# EAGLE design VisualightMicroBulb_03 (EAGLE 6.2)
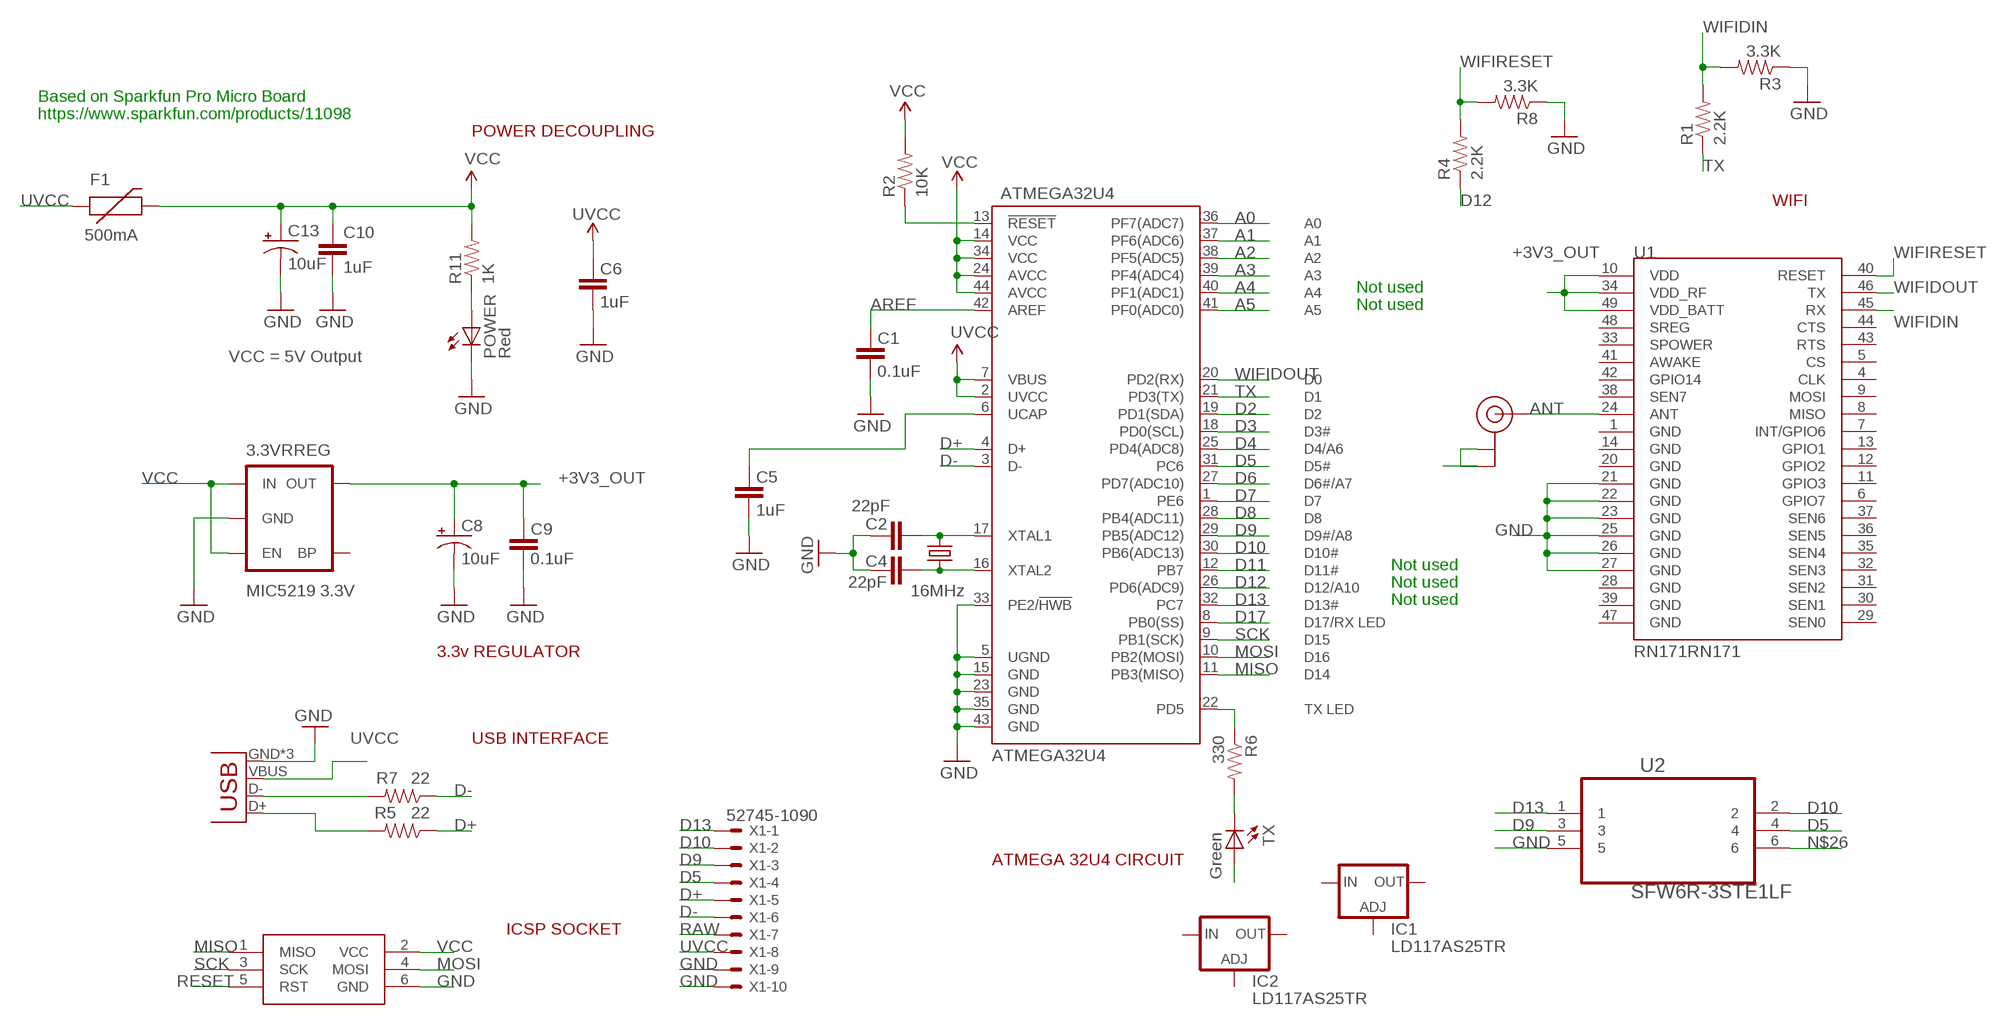
[diagram p0: schematic, sheet 1]

## Parts
3.3VRREG  MIC5219 3.3V  V_REG_MIC52193.3V  [SOT23-5]
ATMEGA32U4  ATMEGA32U4  ATMEGA32U4TQFP  [SPARKFUN-DIGITALIC_TQFP44]
C1  0.1uF  CAP0402-CAP  [0402-CAP]
C2  22pF  CAP0402-CAP  [0402-CAP]
C4  22pF  CAP0402-CAP  [0402-CAP]
C5  1uF  CAP0402-CAP  [0402-CAP]
C6  1uF  CAP0402-CAP  [0402-CAP]
C8  10uF  CAP_POL1206  [EIA3216]
C9  0.1uF  CAP0402-CAP  [0402-CAP]
C10  1uF  CAP0402-CAP  [0402-CAP]
C13  10uF  CAP_POL1206  [EIA3216]
F1  500mA  PTCSMD  [PTC-1206]
IC1  LD117AS25TR  [SOT223]
IC2  LD117AS25TR  [SOT223]
ISP1  AVRISP-6  [AVRISP]
POWER  Red  LED0603  [LED-0603]
R1  2.2K  RESISTOR0402-RES  [0402-RES]
R2  10K  RESISTOR0402-RES  [0402-RES]
R3  3.3K  RESISTOR0402-RES  [0402-RES]
R4  2.2K  RESISTOR0402-RES  [0402-RES]
R5  22  RESISTOR0402-RES  [0402-RES]
R6  330  RESISTOR0402-RES  [0402-RES]
R7  22  RESISTOR0402-RES  [0402-RES]
R8  3.3K  RESISTOR0402-RES  [0402-RES]
R11  1K  RESISTOR0402-RES  [0402-RES]
TX  Green  LED0603  [LED-0603]
U1  RN171RN171  [RN171]
U2  SFW6R-3STE1LF  [FCI_SFW6R-3STE1LF]
U$1  U.FL  [U.FL]
X1  52745-1090  [52745-1090]
X2  USB-MICROB  [USB-MICROB]
Y1  16MHz  CRYSTAL5X3  [CRYSTAL-SMD-5X3]

## Nets
+3V3_OUT: 3.3VRREG.5(OUT) C8.A(+) C9.2 U1.10(VDD) U1.34(VDD_RF) U1.49(VDD_BATT)
A0: ATMEGA32U4.36(PF7(ADC7))
A1: ATMEGA32U4.37(PF6(ADC6))
A2: ATMEGA32U4.38(PF5(ADC5))
A3: ATMEGA32U4.39(PF4(ADC4))
A4: ATMEGA32U4.40(PF1(ADC1))
A5: ATMEGA32U4.41(PF0(ADC0))
ANT: U1.24(ANT) U$1.P$3(SIGNAL)
AREF: ATMEGA32U4.42(AREF) C1.2
D2: ATMEGA32U4.19(PD1(SDA))
D3: ATMEGA32U4.18(PD0(SCL))
D4: ATMEGA32U4.25(PD4(ADC8))
D5: ATMEGA32U4.31(PC6) U2.4 X1.4
D6: ATMEGA32U4.27(PD7(ADC10))
D7: ATMEGA32U4.1(PE6)
D8: ATMEGA32U4.28(PB4(ADC11))
D9: ATMEGA32U4.29(PB5(ADC12)) U2.3 X1.3
D10: ATMEGA32U4.30(PB6(ADC13)) U2.2 X1.2
D11: ATMEGA32U4.12(PB7)
D12: ATMEGA32U4.26(PD6(ADC9)) R4.1
D13: ATMEGA32U4.32(PC7) U2.1 X1.1
D17: ATMEGA32U4.8(PB0(SS))
D+: ATMEGA32U4.4(D+) R5.1 X1.5
D-: ATMEGA32U4.3(D-) R7.1 X1.6
GND [vcc]: 3.3VRREG.2(GND) ATMEGA32U4.5(UGND) ATMEGA32U4.15(GND) ATMEGA32U4.23(GND) ATMEGA32U4.33(PE2/!HWB) ATMEGA32U4.35(GND) ATMEGA32U4.43(GND) C1.1 C2.2 C4.2 C5.1 C6.1 C8.C(-) C9.1 C10.2 C13.C(-) ISP1.6(GND) POWER.C R3.1 R8.1 U1.21(GND) U1.22(GND) U1.23(GND) U1.25(GND) U1.26(GND) U1.27(GND) U2.5 U$1.P$1(GND) U$1.P$2(GND) X1.9 X1.10 X2.GND X2.MT1(GND) X2.MT2(GND)
MISO: ATMEGA32U4.11(PB3(MISO)) ISP1.1(MISO)
MOSI: ATMEGA32U4.10(PB2(MOSI)) ISP1.4(MOSI)
N$1: ATMEGA32U4.16(XTAL2) C4.1 Y1.1
N$2: ATMEGA32U4.17(XTAL1) C2.1 Y1.3
N$4: ATMEGA32U4.6(UCAP) C5.2
N$6: R7.2 X2.D-
N$7: R6.2 TX.C
N$8: R5.2 X2.D+
N$26: U2.6
N$38: POWER.A R11.1
RAW: X1.7
RESET: ATMEGA32U4.13(!RESET) ISP1.5(RST) R2.1
SCK: ATMEGA32U4.9(PB1(SCK)) ISP1.3(SCK)
TX: ATMEGA32U4.21(PD3(TX)) R1.1
TXLED: ATMEGA32U4.22(PD5) R6.1
UVCC: ATMEGA32U4.2(UVCC) ATMEGA32U4.7(VBUS) C6.2 F1.1 X1.8 X2.VBUS
VCC: 3.3VRREG.1(IN) 3.3VRREG.3(EN) ATMEGA32U4.14(VCC) ATMEGA32U4.24(AVCC) ATMEGA32U4.34(VCC) ATMEGA32U4.44(AVCC) C10.1 C13.A(+) F1.2 ISP1.2(VCC) R2.2 R11.2 TX.A
WIFIDIN: R1.2 R3.2 U1.45(RX)
WIFIDOUT: ATMEGA32U4.20(PD2(RX)) U1.46(TX)
WIFIRESET: R4.2 R8.2 U1.40(RESET)
Unconnected: 3.3VRREG.4(BP) IC1.1(ADJ) IC1.3(IN) IC1.4(OUT) IC2.1(ADJ) IC2.3(IN) IC2.4(OUT) U1.1(GND) U1.4(CLK) U1.5(CS) U1.6(GPIO7) U1.7(INT/GPIO6) U1.8(MISO) U1.9(MOSI) U1.11(GPIO3) U1.12(GPIO2) U1.13(GPIO1) U1.14(GND) U1.20(GND) U1.28(GND) U1.29(SEN0) U1.30(SEN1) U1.31(SEN2) U1.32(SEN3) U1.33(SPOWER) U1.35(SEN4) U1.36(SEN5) U1.37(SEN6) U1.38(SEN7) U1.39(GND) U1.41(AWAKE) U1.42(GPIO14) U1.43(RTS) U1.44(CTS) U1.47(GND) U1.48(SREG)

## Notes on the sheet
- Based on Sparkfun Pro Micro Board
- https://www.sparkfun.com/products/11098
- POWER DECOUPLING
- WIFI
- Not used
- Not used
- VCC = 5V Output
- Not used
- Not used
- Not used
- 3.3v REGULATOR
- USB INTERFACE
- ATMEGA 32U4 CIRCUIT
- ICSP SOCKET

## Library data of the parts
3.3VRREG = SparkFun-PowerIC:V_REG_MIC5219: V_REG MIC5219 Standard 500mA LDO voltage regulator in SOT-23 layout. Micrel part MIC5219. BP (by-pass) pin is used to lower output noise with 470pF cap, may be left open.; PROD_ID: VREG-09872
ATMEGA32U4 = SparkFun-DigitalIC:ATMEGA32U4: Atmel 44-pin 8-bit Microcontroller with 32KBytes of ISP Flash and USB Controller
C1 C2 C4-C6 C9 C10 = SparkFun:CAP: Capacitor Standard 0603 ceramic capacitor, and 0.1" leaded capacitor.
C8 C13 = SparkFun:CAP_POL: Capacitor Polarized These are standard SMD and PTH capacitors. Normally 10uF, 47uF, and 100uF in electrolytic and tantalum varieties. Always verify the external diameter of the through hole cap, it varies with capacity, voltage, and manufacturer. The EIA devices should be standard.
F1 = SparkFun:PTC: Resettable Fuse PTC Resettable Fuse. Spark Fun Electronics SKU : COM-08357
IC1 IC2 = v-reg:LD117A?*: Low drop fixed and adjustable positive voltage regulators 1 A Source: http://www.st.com/stonline/products/literature/ds/7194/ld1117axx.pdf
ISP1 = adafruit:AVRISP: AVR ISP HEADER Standard 6 pin header for AVR programming
POWER TX = SparkFun:LED: LEDs Standard schematic elements and footprints for 5mm, 3mm, 1206, and 0603 sized LEDs. 5mm - Spark Fun Electronics SKU : COM-00529 (and others)
R1-R8 R11 = SparkFun:RESISTOR: Resistor Basic schematic elements and footprints for 0603, 1206, and PTH resistors.
U1 = SparkFun-RF:RN171: WiFi Module
U2 = FCI_By_element14_Batch_1:SFW6R-3STE1LF: FFC/FPC CONNECTOR, RECEPTACLE, 6POS 1ROW; MPN: SFW6R-3STE1LF; OC_FARNELL: 1835600; OC_NEWARK: 62K5642; PACKAGE: CONNECTOR-6POS; SUPPLIER: FCI
U$1 = SparkFun-Connectors:U.FL: SMD antenna connector- WRL-09144
X1 = con-molex:52745-1090: FFC/FPC-to-Board 0.50mm (.020") SMT Top Contact Right Angle, ZIF, Style Receptacle 52745 / 52435 Source: http://www.molex.com/product/ffc/52745.html; MPN: 52745-1090; OC_FARNELL: unknown; OC_NEWARK: 92M6380
X2 = SparkFun-Connectors:USB: USB Connectors USB-B-PTH is fully proven SKU : PRT-00139/CONN-08278 USB-miniB is fully proven SKU : PRT-00587 USB-A-PCB is untested. USB-A-H is throughly reviewed, but untested. Spark Fun Electronics SKU : PRT-00437 USB-B-SMT is throughly reviewed, but untested. Needs silkscreen touching up. USB-A-S has not been used/tested USB-MB-H has not been used/tested USB-MICROB has been used. CONN-09505; PROD_ID: CONN-09505
Y1 = SparkFun:CRYSTAL: Crystals Various standard crystals. Proven footprints. Spark Fun Electronics SKU : COM-00534

## Net classes
0 default: width 0.003 mm, drill 0.254 mm, clearance 0.152 mm

## Board
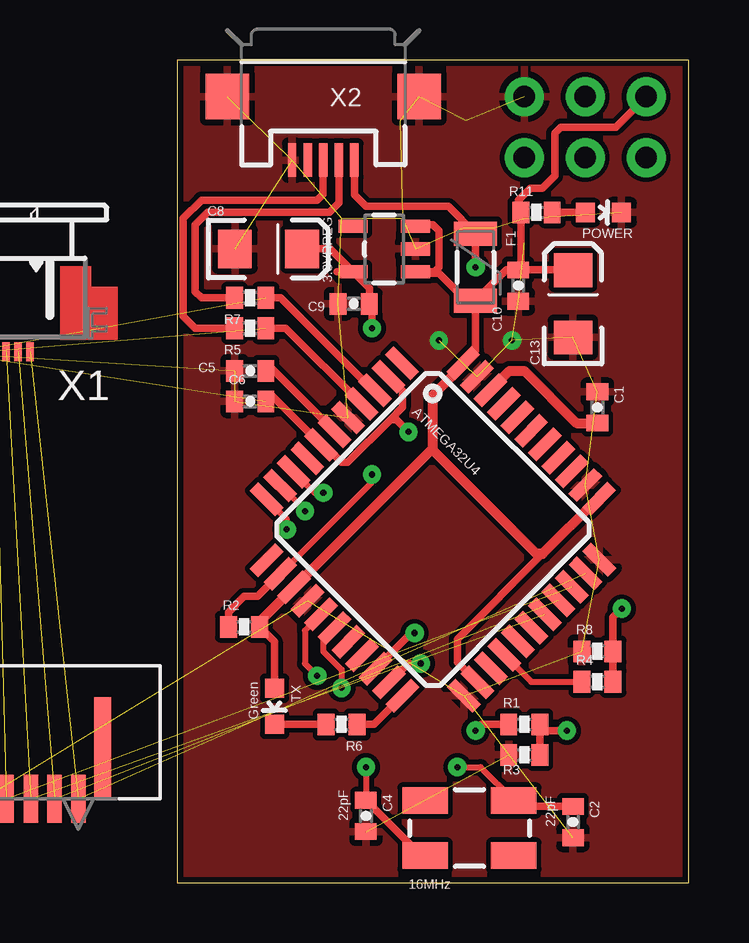
[diagram p1: board, top side]
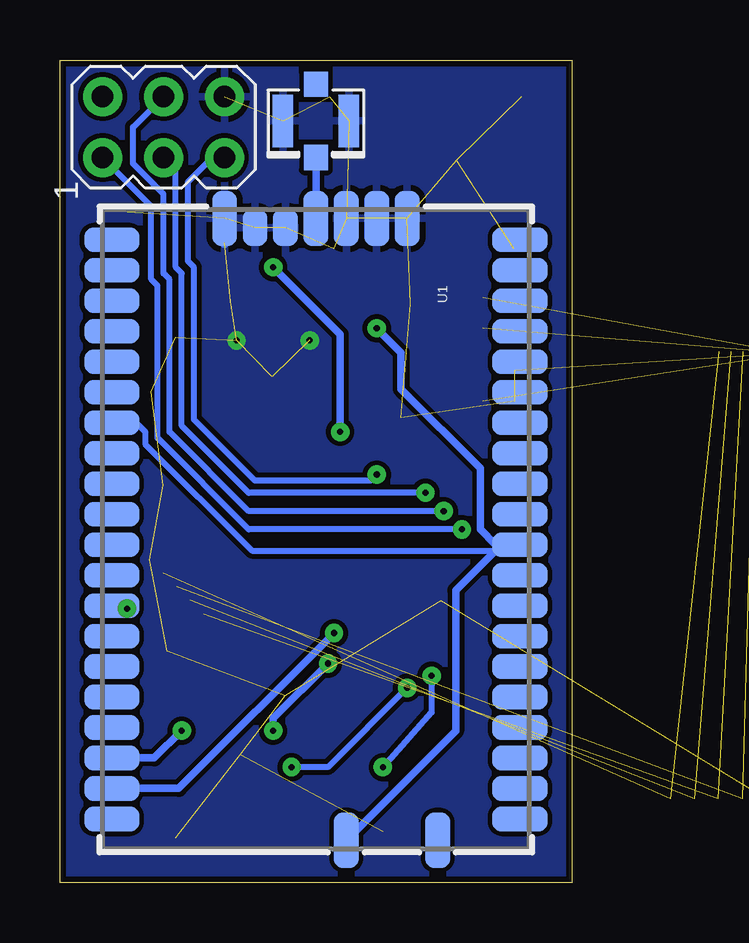
[diagram p2: board, bottom side, seen from below]

Size 21.34 x 34.29 mm. Coordinates in mm from the lower left corner, seen from the top.
Outline: 0,34.29 0,0 21.34,0 21.34,34.29 0,34.29
Copper layers (1*16): Top 0.035mm / dielectric 1.5mm / Bottom 0.035mm
Design rules: minimum track width 8mil, minimum drill 20mil, track to track 8mil, track to pad 8mil, pad to pad 8mil, via to via 8mil, smd to smd 8mil, copper to edge 10mil, drill to drill 8mil, minimum pad ring 12mil, minimum via ring 10mil, stop-mask expansion 4mil, vias tented up to drill 25mil, thermal gap 10mil

### Footprints (pad centres in the part's own frame; a part is rotated, then mirrored left to right if it is on the bottom)
SOT23-5 = smd 0.55 x 1.2: 1 -0.95,-1.3; 2 0,-1.3; 3 0.95,-1.3; 4 0.95,1.3; 5 -0.95,1.3
SPARKFUN-DIGITALIC_TQFP44 = smd 1.5 x 0.5: 1 -5.8,4; 2 -5.8,3.2; 3 -5.8,2.4; 4 -5.8,1.6; 5 -5.8,0.8; 6 -5.8,0; 7 -5.8,-0.8; 8 -5.8,-1.6; 9 -5.8,-2.4; 10 -5.8,-3.2; 11 -5.8,-4; 23 5.8,-4; 24 5.8,-3.2; 25 5.8,-2.4; 26 5.8,-1.6; 27 5.8,-0.8; 28 5.8,0; 29 5.8,0.8; 30 5.8,1.6; 31 5.8,2.4; 32 5.8,3.2; 33 5.8,4 | smd 0.5 x 1.5: 12 -4,-5.8; 13 -3.2,-5.8; 14 -2.4,-5.8; 15 -1.6,-5.8; 16 -0.8,-5.8; 17 0,-5.8; 18 0.8,-5.8; 19 1.6,-5.8; 20 2.4,-5.8; 21 3.2,-5.8; 22 4,-5.8; 34 4,5.8; 35 3.2,5.8; 36 2.4,5.8; 37 1.6,5.8; 38 0.8,5.8; 39 0,5.8; 40 -0.8,5.8; 41 -1.6,5.8; 42 -2.4,5.8; 43 -3.2,5.8; 44 -4,5.8
0402-CAP = smd 0.7 x 0.9: 1 -0.65,0; 2 0.65,0
EIA3216 = smd 1.4 x 1.6: A 1.4,0; C -1.4,0
PTC-1206 = smd 1 x 1.8: 1 -1.4,0; 2 1.4,0
SOT223 = smd 1.5 x 2: 1 -2.3,-3.15; 2 0,-3.15; 3 2.3,-3.15 | smd 3.8 x 2: 4 0,3.15
AVRISP = drill 0.9 pad 1.626: 1 -1.27,2.54; 2 1.27,2.54; 3 -1.27,0; 4 1.27,0; 5 -1.27,-2.54; 6 1.27,-2.54
LED-0603 = smd 0.8 x 0.8: A 0,-0.75; C 0,0.75
0402-RES = smd 0.7 x 0.9: 1 -0.65,0; 2 0.65,0
RN171 = smd 1.016 x 2.286: 1 12.065,8.509; 2 10.795,8.509; 3 9.525,8.509; 4 8.255,8.509; 5 6.985,8.509; 6 5.715,8.509; 7 4.445,8.509; 8 3.175,8.509; 9 1.905,8.509; 10 0.635,8.509; 11 -0.635,8.509; 12 -1.905,8.509; 13 -3.175,8.509; 14 -4.445,8.509; 15 -5.715,8.509; 16 -6.985,8.509; 17 -8.255,8.509; 18 -9.525,8.509; 19 -10.795,8.509; 20 -12.065,8.509; 28 -12.065,-8.509; 29 -10.795,-8.509; 30 -9.525,-8.509; 31 -8.255,-8.509; 32 -6.985,-8.509; 33 -5.715,-8.509; 34 -4.445,-8.509; 35 -3.175,-8.509; 36 -1.905,-8.509; 37 -0.635,-8.509; 38 0.635,-8.509; 39 1.905,-8.509; 40 3.175,-8.509; 41 4.445,-8.509; 42 5.715,-8.509; 43 6.985,-8.509; 44 8.255,-8.509; 45 9.525,-8.509; 46 10.795,-8.509; 47 12.065,-8.509 | smd 2.286 x 1.016: 21 -12.954,3.81; 22 -12.954,2.54; 23 -12.954,1.27; 24 -12.954,0; 27 -12.954,-3.81; 48 12.954,5.08; 49 12.954,1.27 | smd 1.524 x 1.016: 25 -12.573,-1.27; 26 -12.573,-2.54
FCI_SFW6R-3STE1LF = smd 0.61 x 2.007: 1 2.489,2.743; 2 1.499,2.743; 3 0.508,2.743; 4 -0.508,2.743; 5 -1.499,2.743; 6 -2.489,2.743 | smd 0.711 x 4.191: 7 -3.505,4.877; 8 3.505,4.877
U.FL = smd 2.2 x 0.85: P$1 0,1.375; P$2 0,-1.375 | smd 1.05 x 1: P$3 1.525,0; P$4 -1.525,0
52745-1090 = smd 0.3 x 0.8: 1 -2.25,2.5; 2 -1.75,2.5; 3 -1.25,2.5; 4 -0.75,2.5; 5 -0.25,2.5; 6 0.25,2.5; 7 0.75,2.5; 8 1.25,2.5; 9 1.75,2.5; 10 2.25,2.5
USB-MICROB = smd 0.35 x 1.4: D+ 0,2.65; D- -0.65,2.65; GND 1.3,2.65; ID 0.65,2.65; VBUS -1.3,2.65 | smd 1.8 x 1.9: MT1 -4,0; MT2 4,0
CRYSTAL-SMD-5X3 = smd 1.9 x 1.1: 1 -1.85,-1.15; 2 1.85,-1.15; 3 1.85,1.15; 4 -1.85,1.15

### Placement (x,y rotation side)
3.3VRREG  8.64,26.42 90 top
ATMEGA32U4  10.67,14.73 315.1 top
C1  17.53,19.81 270 top
C2  16.51,2.54 270 top
C4  7.87,2.79 270 top
C5  3.05,21.34 0 top
C6  3.05,20.07 0 top
C8  3.81,26.42 0 top
C9  7.37,24.13 0 top
C10  14.22,24.89 270 top
C13  16.51,24.13 90 top
F1  12.45,25.65 270 top
IC1  -17.78,3.56 0 top  (outside the outline)
IC2  -26.16,3.56 0 top  (outside the outline)
ISP1  17.02,31.5 90 bottom
POWER  17.78,27.94 270 top
R1  14.48,6.6 0 top
R2  2.79,10.67 0 top
R3  14.48,5.33 0 top
R4  17.53,8.38 0 top
R5  3.05,23.11 180 top
R6  6.86,6.6 180 top
R7  3.05,24.38 180 top
R8  17.53,9.65 0 top
R11  14.99,27.94 180 top
TX  4.06,7.37 180 top
U1  10.67,14.73 270 bottom
U2  -6.6,0.76 0 top  (outside the outline)
U$1  10.67,31.75 270 bottom
X1  -8.38,24.64 180 top  (outside the outline)
X2  6.1,32.77 180 top
Y1  12.19,2.29 0 top

### Tracks (layer width: path | path; a pad name or v marks a point on that pad's centre or on a via)
+3V3_OUT  (via drill 0.25 pad 0.25)
  Top 0.305: C8.A 6.39,26.42 3.3VRREG.5 | 3.3VRREG.5 6.67,25.47 | 3.3VRREG.5 8.02,24.79 C9.2 8.13,24.02 v8.13,23.11
  Bottom 0.254: U1.34 18.16,19.18 17.78,18.8 17.78,18.29 13.34,13.84 3.18,13.84
  Bottom 0.305: U1.49 4.83,6.35 4.83,12.19 3.18,13.84 2.92,14.1 U1.10 3.18,14.1 3.81,14.73 3.81,17.27 7.11,20.57 7.11,22.1 v8.13,23.11
ANT
  Bottom 0.305: U1.24 U$1.P$3
AREF
  Top 0.406: ATMEGA32U4.42 13.86,21.34 14.48,21.34 16.65,19.16 C1.2
D2
  Top 0.406: ATMEGA32U4.19
D5  (2 unrouted)
D9  (2 unrouted)
D10  (2 unrouted)
D12
  Top 0.254: ATMEGA32U4.26 14.77,8.38 R4.1
D13  (2 unrouted)
D+  (1 unrouted)
  Top 0.305: R5.1 4.53,23.11 ATMEGA32U4.4
D-  (1 unrouted)
  Top 0.305: ATMEGA32U4.3 8.18,20.53 4.32,24.38 R7.1
GND  (via drill 0.25 pad 0.25)  (35 unrouted)
  Bottom 0.406: U1.27 14.48,26.67
  other vias: 10.92,22.61 13.97,22.61
  pour Bottom: 21.34,0 0,0 0,34.29 21.34,34.29
  pour Top: 21.34,0 0,0 0,34.29 21.34,34.29
MISO  (via drill 0.25 pad 0.25)
  Top 0.254: ATMEGA32U4.11 4.57,15.16 v4.57,14.73
  Bottom 0.254: ISP1.1 17.53,28.19 17.53,25.15 17.27,24.89 17.27,18.54 13.46,14.73 v4.57,14.73
MOSI  (via drill 0.25 pad 0.25)
  Top 0.254: ATMEGA32U4.10 5.33,15.53 v5.33,15.49
  Bottom 0.254: v5.33,15.49 13.46,15.49 16.76,18.8 16.76,25.15 17.02,25.4 17.02,28.7 18.29,29.97 18.29,31.5 ISP1.4
N$1  (via drill 0.25 pad 0.25)
  Top 0.254: ATMEGA32U4.16 5.33,10.52 5.33,9.14 v5.84,8.64 | v7.87,4.83 C4.1
  Top 0.305: C4.1 10.18,1.14 Y1.1
  Bottom 0.254: v5.84,8.64 5.84,7.11 v7.87,4.83
N$2  (via drill 0.25 pad 0.25)
  Top 0.254: ATMEGA32U4.17 6.1,10.15 6.1,9.65 6.86,8.89 v6.86,8.13 | v11.68,4.83 12.65,4.83 Y1.3
  Top 0.305: Y1.3 14.29,3.19 C2.1
  Bottom 0.254: v6.86,8.13 10.16,4.83 v11.68,4.83
N$4
  Top 0.305: C5.2 3.8,21.59 ATMEGA32U4.6
N$6
  Top 0.305: X2.D- 6.75,28.34 6.35,27.94 1.27,27.94 0.76,27.43 0.76,24.64 1.02,24.38 R7.2
N$7
  Top 0.305: R6.2 4.08,6.6 TX.C
N$8
  Top 0.305: X2.D+ 6.1,28.7 5.84,28.45 1.02,28.45 0.25,27.69 0.25,23.62 0.76,23.11 R5.2
N$38
  Top 0.305: R11.1 POWER.A
RESET  (via drill 0.25 pad 0.25)
  Top 0.254: ATMEGA32U4.13 8.13,16.7 v8.13,17.02
  Top 0.305: 2.14,10.72 2.14,11.29 2.79,11.94 3.36,11.94 ATMEGA32U4.13
  Top 0.406: 2.14,10.72 R2.1
  Bottom 0.254: v8.13,17.02 8.38,16.76 13.21,16.76 15.75,19.3 15.75,25.65 16,25.91 16,29.21 14.99,30.23 ISP1.5
SCK  (via drill 0.25 pad 0.25)
  Top 0.254: ATMEGA32U4.9 5.74,16.26 v6.1,16.26
  Bottom 0.254: v6.1,16.26 13.46,16.26 16.26,19.05 16.26,25.4 16.51,25.65 16.51,29.72 ISP1.3
TX  (via drill 0.25)
  Top 0.305: ATMEGA32U4.21 9.62,9.14 v10.16,9.14 | v12.45,6.35 12.7,6.6 R1.1
  Bottom 0.305: v10.16,9.14 12.45,6.86 v12.45,6.35
TXLED
  Top 0.305: R6.1 8.21,6.6 ATMEGA32U4.22
UVCC  (via drill 0.25 pad 0.25)  (1 unrouted)
  Top 0.305: C6.2 3.93,20.32 ATMEGA32U4.7 6.12,18.26 6.86,17.53 7.11,17.53 8.89,19.3 | X2.VBUS 7.4,28.67 7.87,28.19 11.31,28.19 F1.1 v12.45,25.65 | ATMEGA32U4.2 9.4,20.51 9.4,19.81 8.89,19.3 | v9.65,18.8 9.14,19.3 8.89,19.3
  Bottom 0.305: v12.45,25.65 9.65,22.86 v9.65,18.8
VCC
  Top 0.305: ATMEGA32U4.24 11.68,9.2 11.68,10.16 15.24,13.72 | ATMEGA32U4.44 12.45,22.18 F1.2 | F1.2 12.07,24.25 10.92,25.4 10,25.4 3.3VRREG.1 10.73,25.47 10.92,25.65 10.92,27.18 10.67,27.43 10,27.43 3.3VRREG.3 | ISP1.2 18.29,31.5 16,31.5 15.75,31.24 15.75,29.46 15.24,28.96 14.73,28.96 14.22,28.45 14.22,28.05 R11.2 14.34,25.65 C10.1 | C10.1 13.73,25.54 F1.2 | C10.1 16.5,25.54 C13.A | R2.2 4.06,10.05 TX.A
  Top 0.406: R2.2 3.44,10.89 ATMEGA32U4.14 10.63,18.07 | 10.63,18.07 10.67,18.11 10.67,20.32 11.93,21.58 ATMEGA32U4.44 | ATMEGA32U4.34 17.54,16.02 15.24,13.72 14.99,13.72 10.67,18.03 | 10.67,18.03 | 10.67,18.03 10.63,18.07
WIFIDIN  (via drill 0.25)
  Top 0.305: v16.26,6.35 15.38,6.35 R1.2 R3.2
  Bottom 0.305: v16.26,6.35 17.4,5.21 U1.45
WIFIDOUT  (via drill 0.25)
  Top 0.305: ATMEGA32U4.20 9.76,10.41 v9.91,10.41
  Bottom 0.305: v9.91,10.41 16.38,3.94 U1.46
WIFIRESET  (via drill 0.25)
  Top 0.305: R4.2 R8.2 18.18,11.06 v18.54,11.43
  Bottom 0.305: U1.40 19.05,11.43 v18.54,11.43